# Altium schematic sheet PowerBoard.SchDoc: DriveHUB CardFrame - Backplane Power
size A3; Date: 01/08/22; Engineer: AJC; DocumentNumber: 35-735; Revision: D; SheetNumber: 1; SheetTotal: 3; Manager: AJC
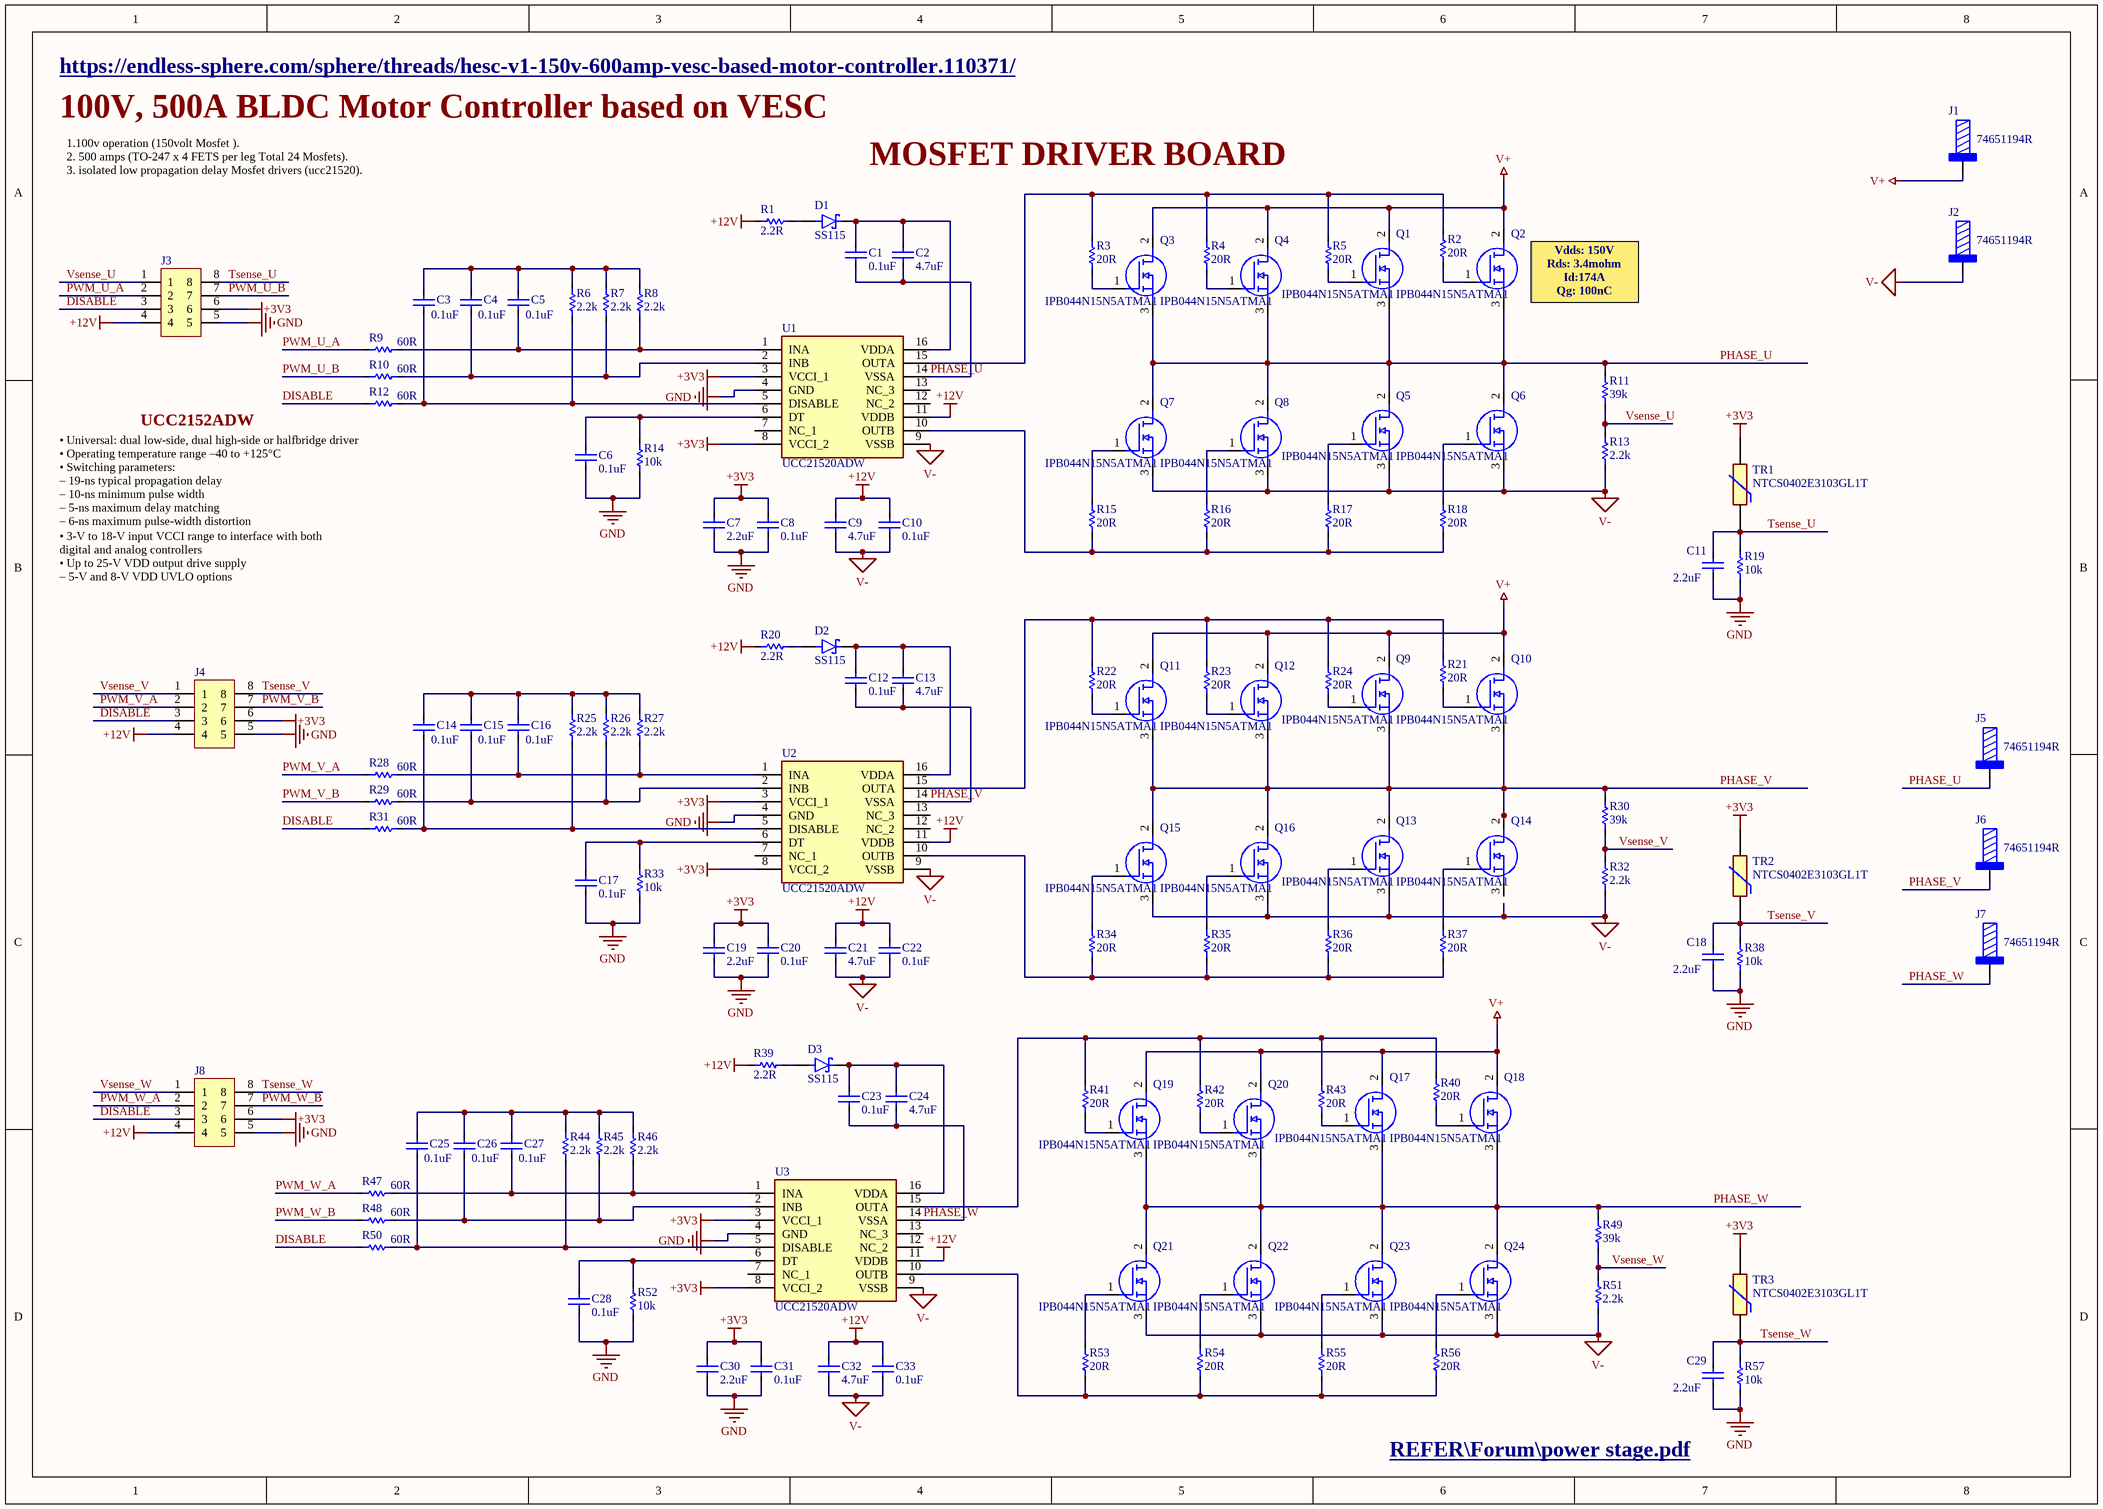
[diagram p0: PowerBoard.SchDoc]

## Parts
C1  0.1uF  [SMD_C(0402)]
C2  4.7uF  [SMD_C(0603)]
C3  0.1uF  [SMD_C(0402)]
C4  0.1uF  [SMD_C(0402)]
C5  0.1uF  [SMD_C(0402)]
C6  0.1uF  [SMD_C(0402)]
C7  2.2uF  [SMD_C(0603)]
C8  0.1uF  [SMD_C(0402)]
C9  4.7uF  [SMD_C(0603)]
C10  0.1uF  [SMD_C(0402)]
C11  2.2uF  [SMD_C(0402)]
C12  0.1uF  [SMD_C(0402)]
C13  4.7uF  [SMD_C(0603)]
C14  0.1uF  [SMD_C(0402)]
C15  0.1uF  [SMD_C(0402)]
C16  0.1uF  [SMD_C(0402)]
C17  0.1uF  [SMD_C(0402)]
C18  2.2uF  [SMD_C(0402)]
C19  2.2uF  [SMD_C(0603)]
C20  0.1uF  [SMD_C(0402)]
C21  4.7uF  [SMD_C(0603)]
C22  0.1uF  [SMD_C(0402)]
C23  0.1uF  [SMD_C(0402)]
C24  4.7uF  [SMD_C(0603)]
C25  0.1uF  [SMD_C(0402)]
C26  0.1uF  [SMD_C(0402)]
C27  0.1uF  [SMD_C(0402)]
C28  0.1uF  [SMD_C(0402)]
C29  2.2uF  [SMD_C(0402)]
C30  2.2uF  [SMD_C(0603)]
C31  0.1uF  [SMD_C(0402)]
C32  4.7uF  [SMD_C(0603)]
C33  0.1uF  [SMD_C(0402)]
D1  SS115  [DIOM4325X250N]
D2  SS115  [DIOM4325X250N]
D3  SS115  [DIOM4325X250N]
J1  74651194R  [74651194]
J2  74651194R  [74651194]
J3  (no value)  [*]
J4  (no value)  [*]
J5  74651194R  [74651194]
J6  74651194R  [74651194]
J7  74651194R  [74651194]
J8  (no value)  [*]
Q1  IPB044N15N5ATMA1  [TO546P531X1558X2499-3P]
Q2  IPB044N15N5ATMA1  [TO546P531X1558X2499-3P]
Q3  IPB044N15N5ATMA1  [TO546P531X1558X2499-3P]
Q4  IPB044N15N5ATMA1  [TO546P531X1558X2499-3P]
Q5  IPB044N15N5ATMA1  [TO546P531X1558X2499-3P]
Q6  IPB044N15N5ATMA1  [TO546P531X1558X2499-3P]
Q7  IPB044N15N5ATMA1  [TO546P531X1558X2499-3P]
Q8  IPB044N15N5ATMA1  [TO546P531X1558X2499-3P]
Q9  IPB044N15N5ATMA1  [TO546P531X1558X2499-3P]
Q10  IPB044N15N5ATMA1  [TO546P531X1558X2499-3P]
Q11  IPB044N15N5ATMA1  [TO546P531X1558X2499-3P]
Q12  IPB044N15N5ATMA1  [TO546P531X1558X2499-3P]
Q13  IPB044N15N5ATMA1  [TO546P531X1558X2499-3P]
Q14  IPB044N15N5ATMA1  [TO546P531X1558X2499-3P]
Q15  IPB044N15N5ATMA1  [TO546P531X1558X2499-3P]
Q16  IPB044N15N5ATMA1  [TO546P531X1558X2499-3P]
Q17  IPB044N15N5ATMA1  [TO546P531X1558X2499-3P]
Q18  IPB044N15N5ATMA1  [TO546P531X1558X2499-3P]
Q19  IPB044N15N5ATMA1  [TO546P531X1558X2499-3P]
Q20  IPB044N15N5ATMA1  [TO546P531X1558X2499-3P]
Q21  IPB044N15N5ATMA1  [TO546P531X1558X2499-3P]
Q22  IPB044N15N5ATMA1  [TO546P531X1558X2499-3P]
Q23  IPB044N15N5ATMA1  [TO546P531X1558X2499-3P]
Q24  IPB044N15N5ATMA1  [TO546P531X1558X2499-3P]
R1  2.2R  [SMD_R(0402)]
R2  20R  [SMD_R(0402)]
R3  20R  [SMD_R(0402)]
R4  20R  [SMD_R(0402)]
R5  20R  [SMD_R(0402)]
R6  2.2k  [SMD_R(0402)]
R7  2.2k  [SMD_R(0402)]
R8  2.2k  [SMD_R(0402)]
R9  60R  [SMD_R(0402)]
R10  60R  [SMD_R(0402)]
R11  39k  [SMD_R(0402)]
R12  60R  [SMD_R(0402)]
R13  2.2k  [SMD_R(0402)]
R14  10k  [SMD_R(0402)]
R15  20R  [SMD_R(0402)]
R16  20R  [SMD_R(0402)]
R17  20R  [SMD_R(0402)]
R18  20R  [SMD_R(0402)]
R19  10k  [SMD_R(0402)]
R20  2.2R  [SMD_R(0402)]
R21  20R  [SMD_R(0402)]
R22  20R  [SMD_R(0402)]
R23  20R  [SMD_R(0402)]
R24  20R  [SMD_R(0402)]
R25  2.2k  [SMD_R(0402)]
R26  2.2k  [SMD_R(0402)]
R27  2.2k  [SMD_R(0402)]
R28  60R  [SMD_R(0402)]
R29  60R  [SMD_R(0402)]
R30  39k  [SMD_R(0402)]
R31  60R  [SMD_R(0402)]
R32  2.2k  [SMD_R(0402)]
R33  10k  [SMD_R(0402)]
R34  20R  [SMD_R(0402)]
R35  20R  [SMD_R(0402)]
R36  20R  [SMD_R(0402)]
R37  20R  [SMD_R(0402)]
R38  10k  [SMD_R(0402)]
R39  2.2R  [SMD_R(0402)]
R40  20R  [SMD_R(0402)]
R41  20R  [SMD_R(0402)]
R42  20R  [SMD_R(0402)]
R43  20R  [SMD_R(0402)]
R44  2.2k  [SMD_R(0402)]
R45  2.2k  [SMD_R(0402)]
R46  2.2k  [SMD_R(0402)]
R47  60R  [SMD_R(0402)]
R48  60R  [SMD_R(0402)]
R49  39k  [SMD_R(0402)]
R50  60R  [SMD_R(0402)]
R51  2.2k  [SMD_R(0402)]
R52  10k  [SMD_R(0402)]
R53  20R  [SMD_R(0402)]
R54  20R  [SMD_R(0402)]
R55  20R  [SMD_R(0402)]
R56  20R  [SMD_R(0402)]
R57  10k  [SMD_R(0402)]
TR1  NTCS0402E3103GL1T  [THRMC1005X65N]
TR2  NTCS0402E3103GL1T  [THRMC1005X65N]
TR3  NTCS0402E3103GL1T  [THRMC1005X65N]
U1  UCC21520ADW  [SOIC127P1030X265-16N]
U2  UCC21520ADW  [SOIC127P1030X265-16N]
U3  UCC21520ADW  [SOIC127P1030X265-16N]

## Nets
+3V3: C7.2 C8.2 C19.2 C20.2 C30.2 C31.2 J3.6 J4.6 J8.6 TR1.2 TR2.2 TR3.2 U1.3(VCCI_1) U1.8(VCCI_2) U2.3(VCCI_1) U2.8(VCCI_2) U3.3(VCCI_1) U3.8(VCCI_2)
+12V: C9.2 C10.2 C21.2 C22.2 C32.2 C33.2 J3.4 J4.4 J8.4 R1.1 R20.1 R39.1 U1.11(VDDB) U2.11(VDDB) U3.11(VDDB)
GND: C6.1 C7.1 C8.1 C11.1 C17.1 C18.1 C19.1 C20.1 C28.1 C29.1 C30.1 C31.1 J3.5 J4.5 J8.5 R14.1 R19.1 R33.1 R38.1 R52.1 R57.1 U1.4(GND) U2.4(GND) U3.4(GND)
V+: J1.1 Q1.2(D) Q2.2(D) Q3.2(D) Q4.2(D) Q9.2(D) Q10.2(D) Q11.2(D) Q12.2(D) Q17.2(D) Q18.2(D) Q19.2(D) Q20.2(D)
V-: C9.1 C10.1 C21.1 C22.1 C32.1 C33.1 J2.1 Q5.3(S) Q6.3(S) Q7.3(S) Q8.3(S) Q13.3(S) Q15.3(S) Q16.3(S) Q21.3(S) Q22.3(S) Q23.3(S) Q24.3(S) R13.1 R32.1 R51.1 U1.9(VSSB) U2.9(VSSB) U3.9(VSSB)
DISABLE: J3.3 J4.3 J8.3 R12.1 R31.1 R50.1
PHASE_U: C1.1 C2.1 J5.1 Q1.3(S) Q2.3(S) Q3.3(S) Q4.3(S) Q5.2(D) Q6.2(D) Q7.2(D) Q8.2(D) R11.2 U1.14(VSSA)
PHASE_V: C12.1 C13.1 J6.1 Q9.3(S) Q10.3(S) Q11.3(S) Q12.3(S) Q13.2(D) Q14.2(D) Q15.2(D) Q16.2(D) R30.2 U2.14(VSSA)
PHASE_W: C23.1 C24.1 J7.1 Q17.3(S) Q18.3(S) Q19.3(S) Q20.3(S) Q21.2(D) Q22.2(D) Q23.2(D) Q24.2(D) R49.2 U3.14(VSSA)
PWM_U_A: J3.2 R9.1
PWM_U_B: J3.7 R10.1
PWM_V_A: J4.2 R28.1
PWM_V_B: J4.7 R29.1
PWM_W_A: J8.2 R47.1
PWM_W_B: J8.7 R48.1
Tsense_U: C11.2 J3.8 R19.2 TR1.1
Tsense_V: C18.2 J4.8 R38.2 TR2.1
Tsense_W: C29.2 J8.8 R57.2 TR3.1
Vsense_U: J3.1 R11.1 R13.2
Vsense_V: J4.1 R30.1 R32.2
Vsense_W: J8.1 R49.1 R51.2
NetC1_2: C1.2 C2.2 D1.C(K) U1.16(VDDA)
NetC3_1: C3.1 R6.1 R12.2 U1.5(DISABLE)
NetC3_2: C3.2 C4.2 C5.2 R6.2 R7.2 R8.2
NetC4_1: C4.1 R7.1 R10.2 U1.2(INB)
NetC5_1: C5.1 R8.1 R9.2 U1.1(INA)
NetC6_2: C6.2 R14.2 U1.6(DT)
NetC12_2: C12.2 C13.2 D2.C(K) U2.16(VDDA)
NetC14_1: C14.1 R25.1 R31.2 U2.5(DISABLE)
NetC14_2: C14.2 C15.2 C16.2 R25.2 R26.2 R27.2
NetC15_1: C15.1 R26.1 R29.2 U2.2(INB)
NetC16_1: C16.1 R27.1 R28.2 U2.1(INA)
NetC17_2: C17.2 R33.2 U2.6(DT)
NetC23_2: C23.2 C24.2 D3.C(K) U3.16(VDDA)
NetC25_1: C25.1 R44.1 R50.2 U3.5(DISABLE)
NetC25_2: C25.2 C26.2 C27.2 R44.2 R45.2 R46.2
NetC26_1: C26.1 R45.1 R48.2 U3.2(INB)
NetC27_1: C27.1 R46.1 R47.2 U3.1(INA)
NetC28_2: C28.2 R52.2 U3.6(DT)
NetD1_A: D1.A R1.2
NetD2_A: D2.A R20.2
NetD3_A: D3.A R39.2
NetQ1_1: Q1.1(G) R5.1
NetQ2_1: Q2.1(G) R2.1
NetQ3_1: Q3.1(G) R3.1
NetQ4_1: Q4.1(G) R4.1
NetQ5_1: Q5.1(G) R17.2
NetQ6_1: Q6.1(G) R18.2
NetQ7_1: Q7.1(G) R15.2
NetQ8_1: Q8.1(G) R16.2
NetQ9_1: Q9.1(G) R24.1
NetQ10_1: Q10.1(G) R21.1
NetQ11_1: Q11.1(G) R22.1
NetQ12_1: Q12.1(G) R23.1
NetQ13_1: Q13.1(G) R36.2
NetQ14_1: Q14.1(G) R37.2
NetQ15_1: Q15.1(G) R34.2
NetQ16_1: Q16.1(G) R35.2
NetQ17_1: Q17.1(G) R43.1
NetQ18_1: Q18.1(G) R40.1
NetQ19_1: Q19.1(G) R41.1
NetQ20_1: Q20.1(G) R42.1
NetQ21_1: Q21.1(G) R53.2
NetQ22_1: Q22.1(G) R54.2
NetQ23_1: Q23.1(G) R55.2
NetQ24_1: Q24.1(G) R56.2
NetR2_2: R2.2 R3.2 R4.2 R5.2 U1.15(OUTA)
NetR15_1: R15.1 R16.1 R17.1 R18.1 U1.10(OUTB)
NetR21_2: R21.2 R22.2 R23.2 R24.2 U2.15(OUTA)
NetR34_1: R34.1 R35.1 R36.1 R37.1 U2.10(OUTB)
NetR40_2: R40.2 R41.2 R42.2 R43.2 U3.15(OUTA)
NetR53_1: R53.1 R54.1 R55.1 R56.1 U3.10(OUTB)

Not connected (* = marked no-connect by the designer): Q14 3(S); U1 7(NC_1) 12(NC_2) 13(NC_3); U2 7(NC_1) 12(NC_2) 13(NC_3); U3 7(NC_1) 12(NC_2) 13(NC_3)

## Notes on the sheet
- https://endless-sphere.com/sphere/threads/hesc-v1-150v-600amp-vesc-based-motor-controller.110371/
- 100V, 500A BLDC Motor Controller based on VESC
- MOSFET DRIVER BOARD
- 1.100v operation (150volt Mosfet ).
  2. 500 amps (TO-247 x 4 FETS per leg Total 24 Mosfets).
  3. isolated low propagation delay Mosfet drivers (ucc21520).
- (near Q2) Vdds: 150V
  Rds: 3.4mohm
  Id:174A
  Qg: 100nC
- UCC2152ADW
- • 3-V to 18-V input VCCI range to interface with both
  digital and analog controllers
  • Up to 25-V VDD output drive supply
  – 5-V and 8-V VDD UVLO options
- (near R12) • Universal: dual low-side, dual high-side or halfbridge driver
  • Operating temperature range –40 to +125°C
  • Switching parameters:
  – 19-ns typical propagation delay
  – 10-ns minimum pulse width
  – 5-ns maximum delay matching
  – 6-ns maximum pulse-width distortion
- REFER\Forum\power stage.pdf

## Library data of the parts
C1 C3-C6 C8 C10 C12 C14-C17 C20 C22 C23 C25-C28 C31 C33 = Cap_1: Multilayer Ceramic Capacitors MLCC - SMD/SMT 50 V 0.1uF X7R 0603 10%; Manufacturer: Yageo; Manufacturer Part Number: CC0603KPX7R9BB104; Supplier 1: Digi-Key; Supplier Part Number 1: 311-3567-1-ND
C2 C7 C9 C13 C19 C21 C24 C30 C32 = Cap_10: PHE840MA6100MA04R17; Manufacturer: Yageo; Manufacturer Part Number: CC0603KPX7R9BB104; Supplier 1: Digi-Key; Supplier Part Number 1: 311-3567-1-ND
C11 C18 C29 = Cap_1: Multilayer Ceramic Capacitors MLCC - SMD/SMT 50 V 0.1uF X7R 0603 10%
D1-D3 = SS115: 1A, 150V, Schottky Rectifier; MF: Taiwan Semiconductor; Package: DO-214AC-2 Taiwan Semiconductor; Check_prices: https://www.snapeda.com/parts/SS115/Taiwan+Semiconductor/view-part/?ref=eda; Value: *; Price: None; Purchase-URL: https://pricing.snapeda.com/search/part/SS115/?ref=eda; MP: SS115; SnapEDA_Link: https://www.snapeda.com/parts/SS115/Taiwan+Semiconductor/view-part/?ref=snap; Availability: In Stock
J1 J2 J5-J7 = 74651194R: WP-THRSH REDCUBE THR with external thread, M4 x 5mm, 85A; Manufacturer: Wurth Elektronik; Surface: Tin; ComponentLink1Description: Website Link; ComponentLink1URL: https://www.we-online.com/redexpert/article/74651194R?ad; ComponentLink2Description: Datasheet Link; ComponentLink2URL: https://www.we-online.com/redexpert/spec/74651194R?ad; Manufacturer Part Number: 74651194R; Category: REDCUBE THR; Match Code: WP-THRSH; Mount: Through Hole Reflow; Operating Temperature Max: 150°C; Operating Temperature Min: -55°C; Packaging: Tape and Reel; Length: 10mm; Width: 10mm; Height: 8.5mm; Material: Brass; Number of Pins: 9; Rated Current: 85A; Thread Length: 5mm; Thread Size: M4; Supplier: Mouser; Supplier Part Number: 710-74651195R; Price: 3.5; Value: 74651194R
J3 J4 J8 = PCB Header: 2 Row 2.54mm Pitch 8 pins
Q1-Q24 = AUIRFP4568: MOSFET N-CHANNEL 100+; Manufacturer_Name: Infineon; Geometry.Height: 5.31mm; Mouser Part Number: 942-AUIRFP4568; Mouser Price/Stock: https://www.mouser.co.uk/ProductDetail/Infineon-IR/AUIRFP4568?qs=m1T3c8F5IUIdoWYie9aRBg%3D%3D; Manufacturer_Part_Number: AUIRFP4568; Datasheet Link: https://www.infineon.com/dgdl/auirfp4568.pdf?fileId=5546d462533600a4015355b1d8751458
R1-R5 R9 R10 R12 R15-R18 R20-R24 R28 R29 R31 R34-R37 R39-R43 R47 R48 R50 R53-R56 = Res Semi_1: CRCW04024R02FKED; Published: 8-Jun-2000; LatestRevisionDate: 17-Jul-2002; LatestRevisionNote: Re-released for DXP Platform.; PackageReference: AXIAL-0.5; Publisher: Altium Limited; PackageDescription: Axial Device, Thru-Hole; 2 Leads; 0.5 in Pin Spacing
R6-R8 R25-R27 R44-R46 = Res Semi_2: CRCW04024R02FKED; Published: 8-Jun-2000; LatestRevisionDate: 17-Jul-2002; LatestRevisionNote: Re-released for DXP Platform.; PackageReference: AXIAL-0.5; Publisher: Altium Limited; PackageDescription: Axial Device, Thru-Hole; 2 Leads; 0.5 in Pin Spacing
R11 R13 R14 R19 R30 R32 R33 R38 R49 R51 R52 R57 = Res Semi_5: CRCW04024R02FKED; Published: 8-Jun-2000; LatestRevisionDate: 17-Jul-2002; LatestRevisionNote: Re-released for DXP Platform.; PackageReference: AXIAL-0.5; Publisher: Altium Limited; PackageDescription: Axial Device, Thru-Hole; 2 Leads; 0.5 in Pin Spacing
TR1-TR3 = NTCS0402E3103GL1T: NTC Thermistors 10Kohms 2% AEC-Q200; Manufacturer_Name: Vishay; Geometry.Height: 0.65mm; Mouser Part Number: 594-NTCS402E3103GL1T; Mouser Price/Stock: https://www.mouser.co.uk/ProductDetail/Vishay-BC-Components/NTCS0402E3103GL1T?qs=u16ybLDytRYI8lwq3wWutw%3D%3D; Manufacturer_Part_Number: NTCS0402E3103GL1T; Datasheet Link: https://www.mouser.in/datasheet/2/427/ntcs0402e3t-1762119.pdf
U1-U3 = UCC21520ADW: 4A/6A, 5.7 kVrms Isolated Dual Channel Gate Driver; Manufacturer_Name: Texas Instruments; Geometry.Height: 2.65mm; Mouser Part Number: 595-UCC21520ADW; Mouser Price/Stock: https://www.mouser.co.uk/ProductDetail/Texas-Instruments/UCC21520ADW?qs=%2FP2Ij7fVdhFsQr%252B%2F6P1laA%3D%3D; Manufacturer_Part_Number: UCC21520ADW; Datasheet Link: http://www.ti.com/lit/gpn/ucc21520